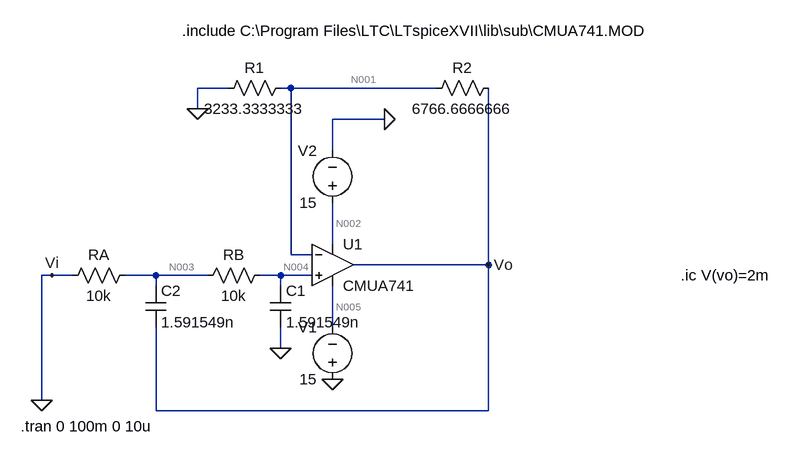
[diagram p0: schematic part A op amp stepping resistors.asc]
part A op amp stepping resistors.asc, the LTspice schematic file:
Version 4
SHEET 1 1484 680
WIRE 144 -128 96 -128
WIRE 240 -128 224 -128
WIRE 464 -128 240 -128
WIRE 96 -96 96 -128
WIRE 384 -80 304 -80
WIRE 304 -32 304 -80
WIRE 304 112 304 48
WIRE 240 128 240 -128
WIRE 272 128 240 128
WIRE 544 144 544 -128
WIRE 544 144 336 144
WIRE -128 160 -144 160
WIRE -96 160 -128 160
WIRE 32 160 -16 160
WIRE 112 160 32 160
WIRE 224 160 192 160
WIRE 272 160 224 160
WIRE 32 176 32 160
WIRE 224 176 224 160
WIRE 304 240 304 176
WIRE 224 272 224 240
WIRE -144 352 -144 160
WIRE 32 368 32 240
WIRE 544 368 544 144
WIRE 544 368 32 368
FLAG 304 320 0
FLAG 384 -80 0
FLAG 224 272 0
FLAG 96 -96 0
FLAG -144 352 0
FLAG -128 160 Vi
FLAG 544 144 Vo
SYMBOL voltage 304 336 R180
WINDOW 0 24 96 Left 2
WINDOW 3 24 16 Left 2
WINDOW 123 0 0 Left 0
WINDOW 39 0 0 Left 0
SYMATTR InstName V1
SYMATTR Value 15
SYMBOL voltage 304 64 R180
WINDOW 0 24 96 Left 2
WINDOW 3 24 16 Left 2
WINDOW 123 0 0 Left 0
WINDOW 39 0 0 Left 0
SYMATTR InstName V2
SYMATTR Value 15
SYMBOL res 560 -144 R90
WINDOW 0 0 56 VBottom 2
WINDOW 3 32 56 VTop 2
SYMATTR InstName R2
SYMATTR Value 6766.6666666
SYMBOL res 240 -144 R90
WINDOW 0 0 56 VBottom 2
WINDOW 3 32 56 VTop 2
SYMATTR InstName R1
SYMATTR Value 3233.3333333
SYMBOL res 208 144 R90
WINDOW 0 0 56 VBottom 2
WINDOW 3 32 56 VTop 2
SYMATTR InstName RB
SYMATTR Value 10k
SYMBOL res 0 144 R90
WINDOW 0 0 56 VBottom 2
WINDOW 3 32 56 VTop 2
SYMATTR InstName RA
SYMATTR Value 10k
SYMBOL cap 208 176 R0
SYMATTR InstName C1
SYMATTR Value 1.591549n
SYMBOL cap 16 176 R0
SYMATTR InstName C2
SYMATTR Value 1.591549n
SYMBOL OpAmps\\opamp2 304 80 R0
SYMATTR InstName U1
SYMATTR Value CMUA741
TEXT 72 -216 Left 2 !.include C:\\Program Files\\LTC\\LTspiceXVII\\lib\\sub\\CMUA741.MOD
TEXT -176 392 Left 2 !.tran 0 100m 0 10u
TEXT 840 160 Left 2 !.ic V(vo)=2m

The netlist it stands for:
* part A op amp stepping resistors.asc
V1 0 N005 15
V2 N002 0 15
R2 Vo N001 6766.6666666
R1 N001 0 3233.3333333
RB N004 N003 10k
RA N003 0 10k
C1 N004 0 1.591549n
C2 N003 Vo 1.591549n
XU1 N004 N001 N002 N005 Vo CMUA741  ; pins In+ In- V+ V- OUT
.include C:\Program Files\LTC\LTspiceXVII\lib\sub\CMUA741.MOD
.tran 0 100m 0 10u
.ic V(vo)=2m
.backanno
.end

* Results of the author's LTspice run, read from the files saved beside the schematic
* Operating Point, zero values left out:
*   V(n005) = -15 V
*   V(n002) = 15 V
*   V(vo) = 2 mV
*   V(n001) = 467.8 µV
*   V(n004) = -1.554 mV
*   V(n003) = -777.2 µV
*   I(Ra) = -77.72 nA
*   I(Rb) = -77.72 nA
*   I(R1) = 144.7 nA
*   I(R2) = 226.4 nA
*   I(V2) = -1.667 mA
*   I(V1) = -1.667 mA
*   Ix(u1:1) = 77.72 nA
*   Ix(u1:2) = 81.78 nA
*   Ix(u1:3) = 1.667 mA
*   Ix(u1:4) = -1.667 mA
*   Ix(u1:5) = 25.51 mA